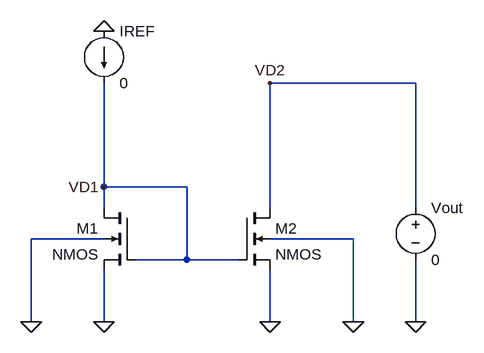
[diagram p0: schematic Chapter03D_01.fig.asc]
Chapter03D_01.fig.asc, the LTspice schematic file:
Version 4
SHEET 1 2940 740
WIRE 256 -144 32 -144
WIRE -224 16 -224 -144
WIRE -96 16 -224 16
WIRE -224 48 -224 16
WIRE 32 48 32 -144
WIRE 256 48 256 -144
WIRE -224 96 -336 96
WIRE 160 96 32 96
WIRE -96 128 -96 16
WIRE -96 128 -176 128
WIRE -16 128 -96 128
WIRE -336 224 -336 96
WIRE -224 224 -224 144
WIRE 32 224 32 144
WIRE 160 224 160 96
WIRE 256 224 256 128
FLAG -224 224 0
FLAG -336 224 0
FLAG 32 224 0
FLAG 160 224 0
FLAG 256 224 0
FLAG -224 -224 0
FLAG 32 -144 VD2
FLAG -224 16 VD1
SYMBOL nmos4 -176 48 M0
SYMATTR InstName M1
SYMBOL nmos4 -16 48 R0
SYMATTR InstName M2
SYMBOL voltage 256 32 R0
SYMATTR InstName Vout
SYMATTR Value 0
SYMBOL current -224 -224 R0
SYMATTR InstName IREF
SYMATTR Value 0

The netlist it stands for:
* Chapter03D_01.fig.asc
M1 VD1 VD1 0 0 NMOS
M2 VD2 VD1 0 0 NMOS
Vout VD2 0 0
IREF 0 VD1 0
.model NMOS NMOS
.model PMOS PMOS
.lib standard.mos
.backanno
.end